# Altium project RobotSoccer.PrjPcb
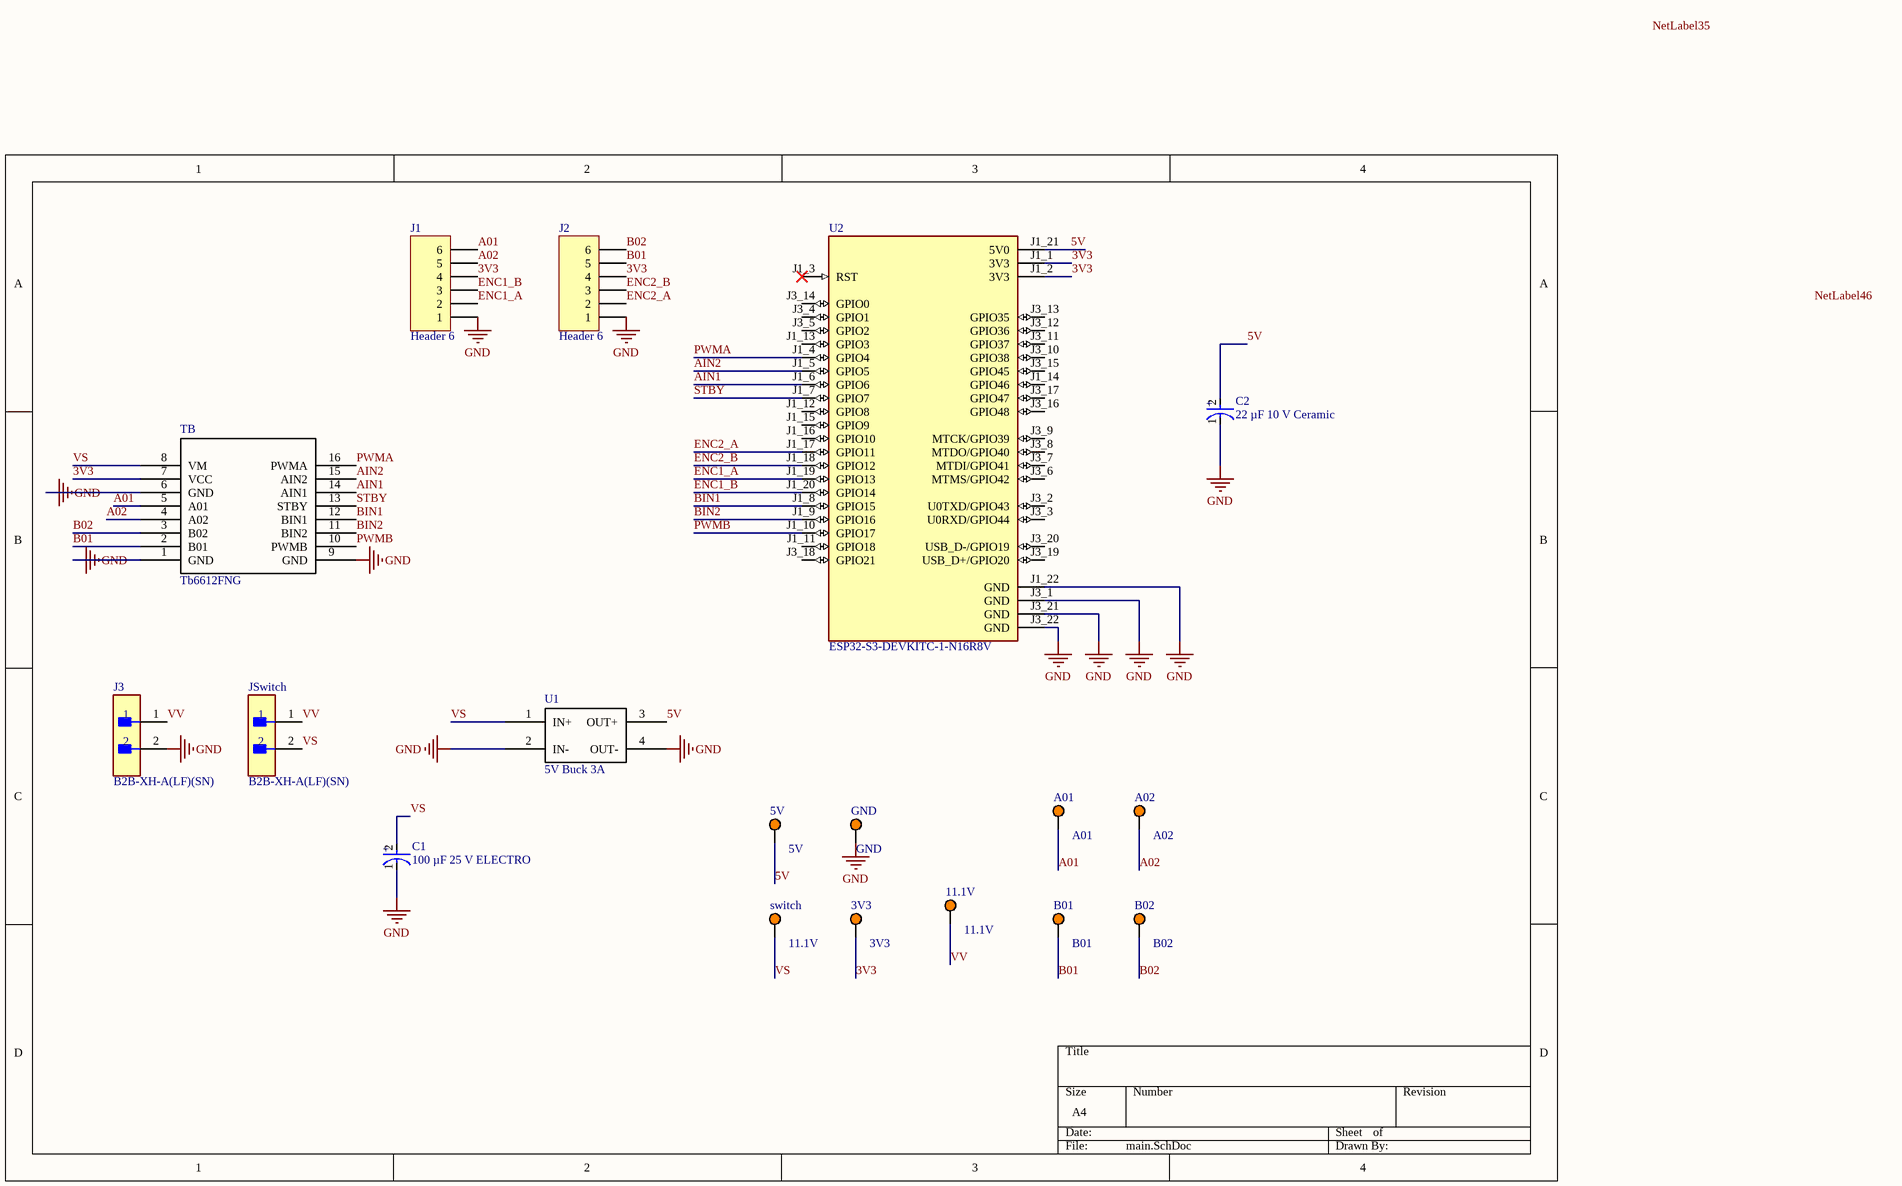
[diagram p0: main.SchDoc]
1 sheet, 18 parts. Net scope: global (net labels, ports and power ports of the same name join across sheets).
Board file: board.PcbDoc

## Sheet main.SchDoc
size A4; SheetNumber: 1; SheetTotal: 1

### Parts
3V3  3V3  [Test-Pin-TH]
5V  5V  [Test-Pin-TH]
11.1V  11.1V  [Test-Pin-TH]
A01  A01  [Test-Pin-TH]
A02  A02  [Test-Pin-TH]
B01  B01  [Test-Pin-TH]
B02  B02  [Test-Pin-TH]
C1  100 µF 25 V ELECTRO  [FP-RAD-TH-D_6_3_0_5-L_11-MFG]
C2  22 µF 10 V Ceramic  [FP-RAD-TH-D_6_3_0_5-L_11-MFG]
GND  GND  [Test-Pin-TH]
J1  Header 6  [HDR1X6]
J2  Header 6  [HDR1X6]
J3  B2B-XH-A(LF)(SN)  [FP-B2B-XH-A_LF_SN-MFG]
JSwitch  B2B-XH-A(LF)(SN)  [FP-B2B-XH-A_LF_SN-MFG]
switch  11.1V  [Test-Pin-TH]
TB  Tb6612FNG  [TB6612FNG]
U1  5V Buck 3A  [BUCK_MINI_3A]
U2  ESP32-S3-DEVKITC-1-N16R8V  [XCVR_ESP32-S3-DEVKITC-1-N16R8V]

### Nets
GND: C1.1(C) C2.1(C) GND.1 J1.1 J2.1 J3.2 TB.1(GND) TB.6(GND) TB.9(GND) U1.2(IN-) U1.4(OUT-) U2.J1_22(GND) U2.J3_1(GND) U2.J3_21(GND) U2.J3_22(GND)
3V3: 3V3.1 J1.4 J2.4 TB.7(VCC) U2.J1_1(3V3) U2.J1_2(3V3)
5V: 5V.1 C2.2(A) U1.3(OUT+) U2.J1_21(5V0)
A01: A01.1 J1.6 TB.5(A01)
A02: A02.1 J1.5 TB.4(A02)
AIN1: TB.14(AIN1) U2.J1_6(GPIO6)
AIN2: TB.15(AIN2) U2.J1_5(GPIO5)
B01: B01.1 J2.5 TB.2(B01)
B02: B02.1 J2.6 TB.3(B02)
BIN1: TB.12(BIN1) U2.J1_8(GPIO15)
BIN2: TB.11(BIN2) U2.J1_9(GPIO16)
ENC1_A: J1.2 U2.J1_19(GPIO13)
ENC1_B: J1.3 U2.J1_20(GPIO14)
ENC2_A: J2.2 U2.J1_17(GPIO11)
ENC2_B: J2.3 U2.J1_18(GPIO12)
PWMA: TB.16(PWMA) U2.J1_4(GPIO4)
PWMB: TB.10(PWMB) U2.J1_10(GPIO17)
STBY: TB.13(STBY) U2.J1_7(GPIO7)
VS: C1.2(A) JSwitch.2 switch.1 TB.8(VM) U1.1(IN+)
VV: 11.1V.1 J3.1 JSwitch.1

Not connected (* = marked no-connect by the designer): U2 J1_3(RST)* J1_11(GPIO18) J1_12(GPIO8) J1_13(GPIO3) J1_14(GPIO46) J1_15(GPIO9) J1_16(GPIO10) J3_2(U0TXD/GPIO43) J3_3(U0RXD/GPIO44) J3_4(GPIO1) J3_5(GPIO2) J3_6(MTMS/GPIO42) J3_7(MTDI/GPIO41) J3_8(MTDO/GPIO40) J3_9(MTCK/GPIO39) J3_10(GPIO38) J3_11(GPIO37) J3_12(GPIO36) J3_13(GPIO35) J3_14(GPIO0) J3_15(GPIO45) J3_16(GPIO48) J3_17(GPIO47) J3_18(GPIO21) J3_19(USB_D+/GPIO20) J3_20(USB_D-/GPIO19)

### Notes on the sheet
- Labels drawn without touching a wire or pin: NetLabel35, NetLabel46
- (in symbol CMP-05427-001480-1) +

### Library data of the parts
3V3 5V 11.1V A01 A02 B01 B02 GND switch = CMP-00024-1: Test pin TH generic
C1 C2 = CMP-05427-001480-1: Aluminum Electrolytic Capacitors (Radial Lead Type) 100uF ±20% 25V
J1 J2 = Header 6: Header, 6-Pin; LatestRevisionDate: 17-Jul-2002; LatestRevisionNote: Re-released for DXP Platform.; Publisher: Altium Limited
J3 JSwitch = CMP-2000-05888-3: CONN HEADER VERT 2POS 2.5MM; Current Rating: 3A; Voltage Rating: 250V; Number of Contacts: 2; Contact Resistance: 20mR; Wire/Cable Gauge: 22AWG; Insulation Resistance: 1GR; Connector Type: Male Pin; Packaging: Bulk; Contact Material: Brass; Lead Free: Lead Free; Orientation: Straight; Contact Plating: Tin; Max Current Rating: 3A; Termination: Solder; Fastening Type: Detent; Depth: 5.75mm; Housing Material: Polyamide; REACH SVHC: No SVHC; Series: XH; Voltage Rating (AC): 250V; Number of Positions: 2; Color: Natural; Contact Type: Male Pin; Max Voltage Rating (DC): 250V; Pitch: 2.5mm; Lead Pitch: 2.5mm; Mount: Through Hole; Max Operating Temperature: 85°C; Length: 7.4mm; Max Voltage Rating (AC): 250V; Min Operating Temperature: -25°C; Number of Rows: 1; Housing Color: White
U1 = BUCK_5V_3A
U2 = ESP32-S3-DEVKITC-1-N16R8V: Development Boards & Kits - Wireless Gen-Purpose Dev Board, embeds ESP32-S3-WROOM-2-N16R8V, 16 MB Octal Flash, 8 MB Octal PSRAM, with Pin Header; MF: Espressif Systems; SnapEDA_Link: https://www.snapeda.com/parts/ESP32-S3-DEVKITC-1-N16R8V/Espressif+Systems/view-part/?ref=snap; Package: None; Value: *; MP: ESP32-S3-DEVKITC-1-N16R8V; Check_prices: https://www.snapeda.com/parts/ESP32-S3-DEVKITC-1-N16R8V/Espressif+Systems/view-part/?ref=eda